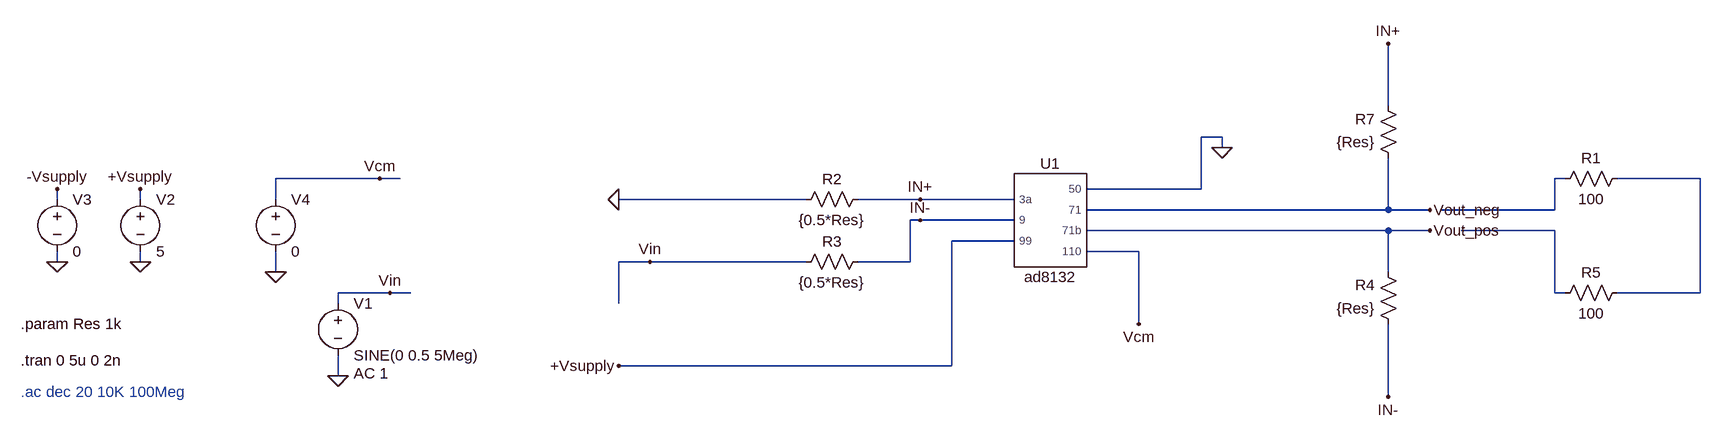
[diagram p0: schematic SE_DE.asc]
SE_DE.asc, the LTspice schematic file:
Version 4
SHEET 1 1684 760
WIRE 1200 128 1200 32
WIRE 944 176 912 176
WIRE 944 192 944 176
WIRE -352 240 -512 240
WIRE -320 240 -352 240
WIRE 1472 240 1456 240
WIRE 1680 240 1552 240
WIRE 912 256 912 176
WIRE 912 256 736 256
WIRE -848 272 -848 256
WIRE -720 272 -720 256
WIRE -512 272 -512 240
WIRE 304 272 16 272
WIRE 480 272 384 272
WIRE 624 272 480 272
WIRE 1200 288 1200 208
WIRE 1200 288 736 288
WIRE 1264 288 1200 288
WIRE 1456 288 1456 240
WIRE 1456 288 1280 288
WIRE 480 304 464 304
WIRE 624 304 480 304
WIRE 1200 320 736 320
WIRE 1264 320 1200 320
WIRE 1456 320 1312 320
WIRE 624 336 528 336
WIRE 816 352 736 352
WIRE -848 368 -848 352
WIRE -720 368 -720 352
WIRE 64 368 16 368
WIRE 304 368 64 368
WIRE 464 368 464 304
WIRE 464 368 384 368
WIRE -512 384 -512 352
WIRE 1200 384 1200 320
WIRE -336 416 -416 416
WIRE -304 416 -336 416
WIRE 1456 416 1456 320
WIRE 1472 416 1456 416
WIRE 1680 416 1680 240
WIRE 1680 416 1552 416
WIRE -416 432 -416 416
WIRE 16 432 16 368
WIRE 816 464 816 352
WIRE 528 528 528 336
WIRE 528 528 16 528
WIRE -416 544 -416 512
WIRE 1200 576 1200 464
FLAG -720 368 0
FLAG -720 256 +Vsupply
FLAG -848 368 0
FLAG -848 256 -Vsupply
FLAG -416 544 0
FLAG -512 384 0
FLAG -352 240 Vcm
FLAG -336 416 Vin
FLAG 64 368 Vin
FLAG 16 272 0
FLAG 16 528 +Vsupply
FLAG 944 192 0
FLAG 1264 288 Vout_neg
FLAG 1264 320 Vout_pos
FLAG 816 464 Vcm
FLAG 480 272 IN+
FLAG 1200 576 IN-
FLAG 480 304 IN-
FLAG 1200 32 IN+
SYMBOL voltage -416 416 R0
WINDOW 123 24 124 Left 2
WINDOW 39 0 0 Left 0
SYMATTR Value2 AC 1
SYMATTR InstName V1
SYMATTR Value SINE(0 0.5 5Meg)
SYMBOL voltage -720 256 R0
WINDOW 123 0 0 Left 0
WINDOW 39 0 0 Left 0
SYMATTR InstName V2
SYMATTR Value 5
SYMBOL voltage -848 256 R0
WINDOW 123 0 0 Left 0
WINDOW 39 0 0 Left 0
SYMATTR InstName V3
SYMATTR Value 0
SYMBOL voltage -512 256 R0
WINDOW 123 0 0 Left 0
WINDOW 39 0 0 Left 0
SYMATTR InstName V4
SYMATTR Value 0
SYMBOL ad8132._Newasy 672 304 R0
SYMATTR InstName U1
SYMBOL res 400 256 R90
WINDOW 0 0 56 VBottom 2
WINDOW 3 32 56 VTop 2
SYMATTR InstName R2
SYMATTR Value {0.5*Res}
SYMBOL res 400 352 R90
WINDOW 0 0 56 VBottom 2
WINDOW 3 32 56 VTop 2
SYMATTR InstName R3
SYMATTR Value {0.5*Res}
SYMBOL res 1216 480 R180
WINDOW 0 36 76 Left 2
WINDOW 3 36 40 Left 2
SYMATTR InstName R4
SYMATTR Value {Res}
SYMBOL res 1216 224 R180
WINDOW 0 36 76 Left 2
WINDOW 3 36 40 Left 2
SYMATTR InstName R7
SYMATTR Value {Res}
SYMBOL res 1568 224 R90
WINDOW 0 0 56 VBottom 2
WINDOW 3 32 56 VTop 2
SYMATTR InstName R1
SYMATTR Value 100
SYMBOL res 1568 400 R90
WINDOW 0 0 56 VBottom 2
WINDOW 3 32 56 VTop 2
SYMATTR InstName R5
SYMATTR Value 100
TEXT -904 464 Left 2 !.param Res 1k
TEXT -904 520 Left 2 !.tran 0 5u 0 2n
TEXT -904 568 Left 2 ;.ac dec 20 10K 100Meg

The netlist it stands for:
* SE_DE.asc
V1 Vin 0 SINE(0 0.5 5Meg) AC 1
V2 +Vsupply 0 5
V3 -Vsupply 0 0
V4 Vcm 0 0
XU1 IN+ IN- +Vsupply 0 Vout_neg Vout_pos Vcm ad8132  ; pins 3a 9 99 50 71 71b 110
R2 IN+ 0 {0.5*Res}
R3 IN- Vin {0.5*Res}
R4 IN- Vout_pos {Res}
R7 Vout_neg IN+ {Res}
R1 N002 N001 100
R5 N002 N003 100
.param Res 1k
.tran 0 5u 0 2n
* .ac dec 20 10K 100Meg
.lib C:\Users\LiChe\Downloads\ad8132.cir
.backanno
.end

* Results of the author's LTspice run, read from the files saved beside the schematic
* Operating Point, zero values left out:
*   V(+vsupply) = 5 V
*   V(in+) = 458.9 mV
*   V(in-) = 457.1 mV
*   V(vout_pos) = 1.37 V
*   V(vout_neg) = 1.375 V
*   I(R2) = 917.7 µA
*   I(R3) = 914.2 µA
*   I(R4) = -912.5 µA
*   I(R7) = 916 µA
*   I(V1) = 914.2 µA
*   I(V2) = -11.23 mA
*   I(V4) = 83.33 µA
*   Ix(u2:3A) = -1.742 µA
*   Ix(u2:9) = -1.742 µA
*   Ix(u2:99) = 11.23 mA
*   Ix(u2:50) = 1.389 A
*   Ix(u2:71) = -916 µA
*   Ix(u2:71B) = -912.5 µA
*   Ix(u2:110) = -83.33 µA
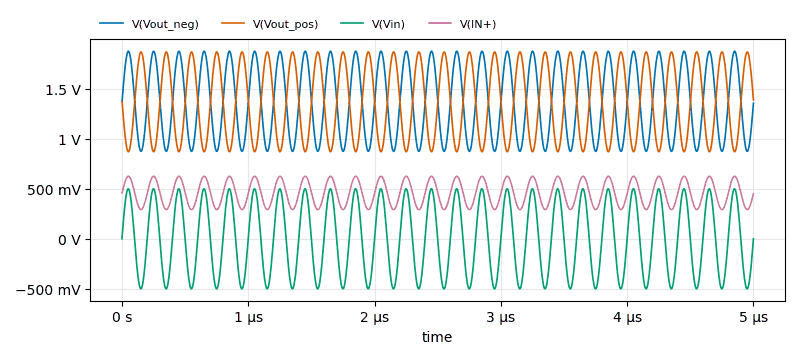
[diagram p1: Transient Analysis of SE_DE.asc, plotted from the saved traces]
* Transient Analysis, 1 run:
*   V(Vout_neg): min 874.3 mV, max 1.875 V, average 1.375 V, rms 1.42 V, last 1.356 V
*   V(Vout_pos): min 870.9 mV, max 1.868 V, average 1.37 V, rms 1.414 V, last 1.389 V
*   V(Vin): min -500 mV, max 500 mV, average -55.49 µV, rms 353.6 mV, last 0 V
*   V(IN+): min 292.3 mV, max 625.4 mV, average 458.8 mV, rms 473.7 mV, last 452.6 mV